# Altium schematic sheet Sheet1.SchDoc
size A4; SheetNumber: 1; SheetTotal: 1
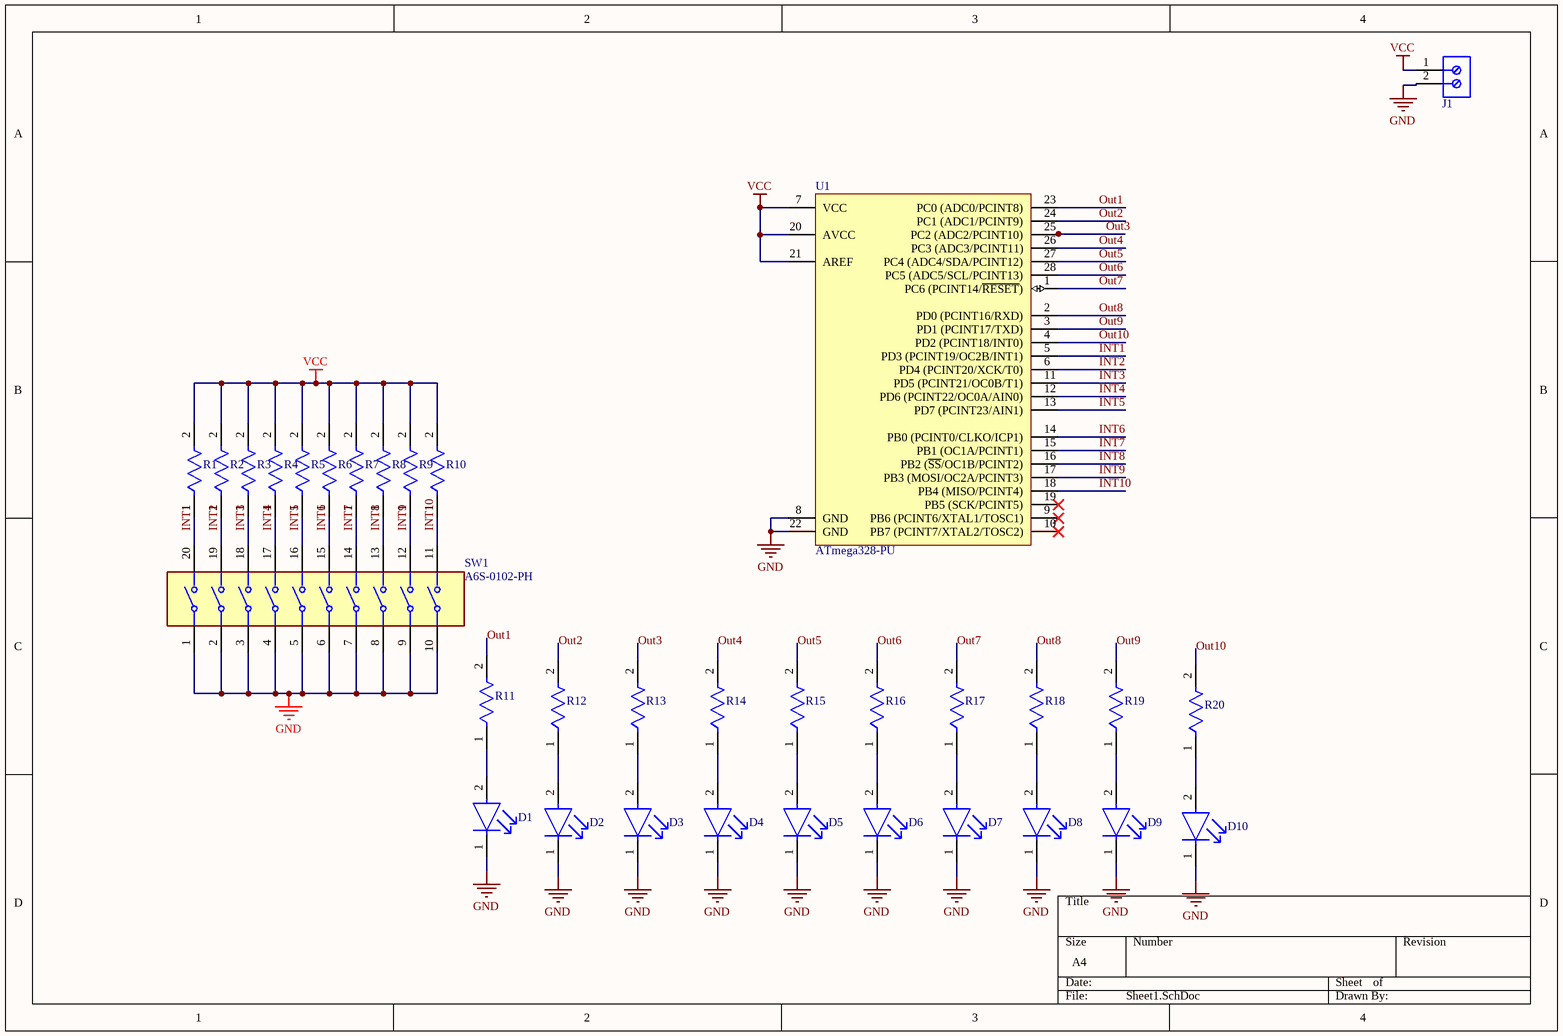
[diagram p0: Sheet1.SchDoc]

## Parts
D1  LTST-C230KRKT  [FP-LTST-C230KRKT-MFG]  (value not drawn)
D2  LTST-C230KRKT  [FP-LTST-C230KRKT-MFG]  (value not drawn)
D3  LTST-C230KRKT  [FP-LTST-C230KRKT-MFG]  (value not drawn)
D4  LTST-C230KRKT  [FP-LTST-C230KRKT-MFG]  (value not drawn)
D5  LTST-C230KRKT  [FP-LTST-C230KRKT-MFG]  (value not drawn)
D6  LTST-C230KRKT  [FP-LTST-C230KRKT-MFG]  (value not drawn)
D7  LTST-C230KRKT  [FP-LTST-C230KRKT-MFG]  (value not drawn)
D8  LTST-C230KRKT  [FP-LTST-C230KRKT-MFG]  (value not drawn)
D9  LTST-C230KRKT  [FP-LTST-C230KRKT-MFG]  (value not drawn)
D10  LTST-C230KRKT  [FP-LTST-C230KRKT-MFG]  (value not drawn)
J1  691214110002  [691214110002]  (value not drawn)
R1  RT0805BRD07249RL  [FP-RT0805-MFG]  (value not drawn)
R2  RT0805BRD07249RL  [FP-RT0805-MFG]  (value not drawn)
R3  RT0805BRD07249RL  [FP-RT0805-MFG]  (value not drawn)
R4  RT0805BRD07249RL  [FP-RT0805-MFG]  (value not drawn)
R5  RT0805BRD07249RL  [FP-RT0805-MFG]  (value not drawn)
R6  RT0805BRD07249RL  [FP-RT0805-MFG]  (value not drawn)
R7  RT0805BRD07249RL  [FP-RT0805-MFG]  (value not drawn)
R8  RT0805BRD07249RL  [FP-RT0805-MFG]  (value not drawn)
R9  RT0805BRD07249RL  [FP-RT0805-MFG]  (value not drawn)
R10  RT0805BRD07249RL  [FP-RT0805-MFG]  (value not drawn)
R11  RT0805BRD07249RL  [FP-RT0805-MFG]  (value not drawn)
R12  RT0805BRD07249RL  [FP-RT0805-MFG]  (value not drawn)
R13  RT0805BRD07249RL  [FP-RT0805-MFG]  (value not drawn)
R14  RT0805BRD07249RL  [FP-RT0805-MFG]  (value not drawn)
R15  RT0805BRD07249RL  [FP-RT0805-MFG]  (value not drawn)
R16  RT0805BRD07249RL  [FP-RT0805-MFG]  (value not drawn)
R17  RT0805BRD07249RL  [FP-RT0805-MFG]  (value not drawn)
R18  RT0805BRD07249RL  [FP-RT0805-MFG]  (value not drawn)
R19  RT0805BRD07249RL  [FP-RT0805-MFG]  (value not drawn)
R20  RT0805BRD07249RL  [FP-RT0805-MFG]  (value not drawn)
SW1  A6S-0102-PH  [FP-A6S-0102-PH-MFG]
U1  ATmega328-PU  [28P3]

## Nets
GND: D1.1(C) D2.1(C) D3.1(C) D4.1(C) D5.1(C) D6.1(C) D7.1(C) D8.1(C) D9.1(C) D10.1(C) J1.2 SW1.1 SW1.2 SW1.3 SW1.4 SW1.5 SW1.6 SW1.7 SW1.8 SW1.9 SW1.10 U1.8(GND) U1.22(GND)
VCC: J1.1 R1.2 R2.2 R3.2 R4.2 R5.2 R6.2 R7.2 R8.2 R9.2 R10.2 U1.7(VCC) U1.20(AVCC) U1.21(AREF)
INT1: R1.1 SW1.20 U1.5(PD3_(PCINT19/OC2B/INT1))
INT2: R2.1 SW1.19 U1.6(PD4_(PCINT20/XCK/T0))
INT3: R3.1 SW1.18 U1.11(PD5_(PCINT21/OC0B/T1))
INT4: R4.1 SW1.17 U1.12(PD6_(PCINT22/OC0A/AIN0))
INT5: R5.1 SW1.16 U1.13(PD7_(PCINT23/AIN1))
INT6: R6.1 SW1.15 U1.14(PB0_(PCINT0/CLKO/ICP1))
INT7: R7.1 SW1.14 U1.15(PB1_(OC1A/PCINT1))
INT8: R8.1 SW1.13 U1.16(PB2_(~{SS}/OC1B/PCINT2))
INT9: R9.1 SW1.12 U1.17(PB3_(MOSI/OC2A/PCINT3))
INT10: R10.1 SW1.11 U1.18(PB4_(MISO/PCINT4))
Out1: R11.2 U1.23(PC0_(ADC0/PCINT8))
Out2: R12.2 U1.24(PC1_(ADC1/PCINT9))
Out3: R13.2 U1.25(PC2_(ADC2/PCINT10))
Out4: R14.2 U1.26(PC3_(ADC3/PCINT11))
Out5: R15.2 U1.27(PC4_(ADC4/SDA/PCINT12))
Out6: R16.2 U1.28(PC5_(ADC5/SCL/PCINT13))
Out7: R17.2 U1.1(PC6_(PCINT14/~{RESET}))
Out8: R18.2 U1.2(PD0_(PCINT16/RXD))
Out9: R19.2 U1.3(PD1_(PCINT17/TXD))
Out10: R20.2 U1.4(PD2_(PCINT18/INT0))
NetD1_2: D1.2(A) R11.1
NetD2_2: D2.2(A) R12.1
NetD3_2: D3.2(A) R13.1
NetD4_2: D4.2(A) R14.1
NetD5_2: D5.2(A) R15.1
NetD6_2: D6.2(A) R16.1
NetD7_2: D7.2(A) R17.1
NetD8_2: D8.2(A) R18.1
NetD9_2: D9.2(A) R19.1
NetD10_2: D10.2(A) R20.1

Not connected (* = marked no-connect by the designer): U1 9(PB6_(PCINT6/XTAL1/TOSC1))* 10(PB7_(PCINT7/XTAL2/TOSC2))* 19(PB5_(SCK/PCINT5))*

## Library data of the parts
D1-D10 = CMP-22017-000041-1: LED RED CLEAR CHIP SMD; Dominant Wavelength: 631nm; Lens Color: Colorless; Lens Style: Diffused; Forward Voltage: 2V; Test Current: 20mA; Luminous Intensity: 54mcd; Number of LEDs: 1; Viewing Angle: 130°; Power Rating: 75mW; Forward Current: 30mA; Wavelength: 639nm; Reverse Voltage: 5V; Min Operating Temperature: -55°C; Height: 1.1mm; Length: 3.2mm; Lens Transparency: Clear; Case/Package: 1206; Package Quantity: 1; Width: 1.6mm; Max Operating Temperature: 85°C; Packaging: Tape and Reel; RoHS Compliant: Yes; Mount: Surface Mount; Lead Free: Lead Free; Depth: 1.6mm; Power Dissipation: 75mW; Number of Pins: 2; Number of Elements: 1; Color: Red; Illumination Color: Red; Case Code (Imperial): 1206; Case Code (Metric): 3216; Radiation Hardening: No
J1 = CMP-1502-02464-1: Serie 2141 - 3.50 mm Horizontal Entry Modular with Rising Cage Clamp WR-TBL, 2 pin; Manufacturer: Wurth Elektronik; Pin Number: 2; Pitch: 3.50mm; Datasheet URL: http://katalog.we-online.de/em/datasheet/6912141100xx.pdf; Packaging: Box; Mounting Technology: THT; Package Reference: 691214110002; Manufacturer URL: http://www.we-online.de; Part Number: 691214110002; Publisher: WurthElektronik; Operating Temperature: -40to105degC
R1-R20 = CMP-03412-035801-1: RES SMD 249 OHM 0.1% 1/8W 0805; Manufacturer: Yageo; Power Rating: 0.125W; Voltage Rating: 150V; Value: 249Ω; Temperature Coefficient: 25 ppm/°C; Tolerance: 0.0025; Device Class L2: Resistors; Composition: Thin Film; RoHS: TRUE; Digikey Description: RES SMD 249 OHM 0.1% 1/8W 0805; Octopart: https://octopart.com/rt0805brd07249rl-yageo-1410573; Temperature Range Low: -55°C; Ipc Land Pattern Name: RESC200125X50; Device Class L3: Chip SMD Resistors; Category: Res; Automotive: No; ComponentLink2Description: Datasheet; Manufacturer Part Number: RT0805BRD07249RL; Temperature: -55°C to +155°C; Height: 0.6mm; Mouser Description: Res SMD 249 Ohm .1% 0805; Resistance: 249Ω; ComponentLink2URL: http://www.yageo.com/documents/recent/PYu-RT_1-to-0.01_RoHS_L_9.pdf; Lead Free: Yes; Package: RT0805; Series: RT; Temperature Range High: +155°C; Footprint Url: http://www.yageo.com/exep/pages/download/literatures/PYu-R_Mount_10.pdf; Device Class L1: Passive Components
SW1 = CMP-08827-000074-1: SWITCH SLIDE DIP SPST 25MA 24V; Washable: Yes; Pitch: 0.1inch; Actuator Type: Slide (Standard); Mechanical Life: 1000Cycles; Number of Positions: 10; Actuator Length: 0mm; Contact Resistance: 200mR; Current Rating: 25mA; Weight: 0.87g; Max Operating Temperature: 70°C; Length: 1.037inch; Throw Configuration: SPST; Termination: Gull Wing; Max Voltage Rating (DC): 24V; Voltage Rating (DC): 24V; Package Quantity: 900; Max Current Rating: 25mA; Case/Package: DIP; Contact Plating: Gold; Orientation: Straight; Series: A6S-H; Mount: Surface Mount; Terminal Pitch: 2.54mm; Radiation Hardening: No; Electrical Life: 1000Cycles; RoHS Compliant: Yes; Packaging: Tape and Reel; Min Operating Temperature: -20°C
U1 = CMP-0095-00015-2: 8-bit AVR Microcontroller, 32KB Flash, 1KB EEPROM, 2KB SRAM, 28-pin PDIP, Industrial Grade (-40°C to 85°C); ComponentLink3Description: ATmega48A/48PA/88A/88PA/168A/168PA/328/328P Summary; RevisionNote: DatasheetVersion updated. URLs added.; DatasheetVersion: revD, May-2011; ComponentLink1URL: http://www.atmel.com/; PackageVersion: revB, Sep-2001; PackageDescription: 28-lead (0.300"/7.62mm Wide) Plastic Dual Inline Package (PDIP); PackageReference: 28P3; ComponentLink1Description: Manufacturer URL; ComponentLink2Description: ATmega48A/48PA/88A/88PA/168A/168PA/328/328P Datasheet; ComponentLink3URL: http://www.atmel.com/dyn/resources/prod_documents/8271S.pdf; ComponentLink2URL: http://www.atmel.com/dyn/resources/prod_documents/8271.pdf